# EAGLE design RPi_SPI_outputs_v03 (EAGLE 7.2.0)
AUTHOR: M.Petrilak; VERSION: 03
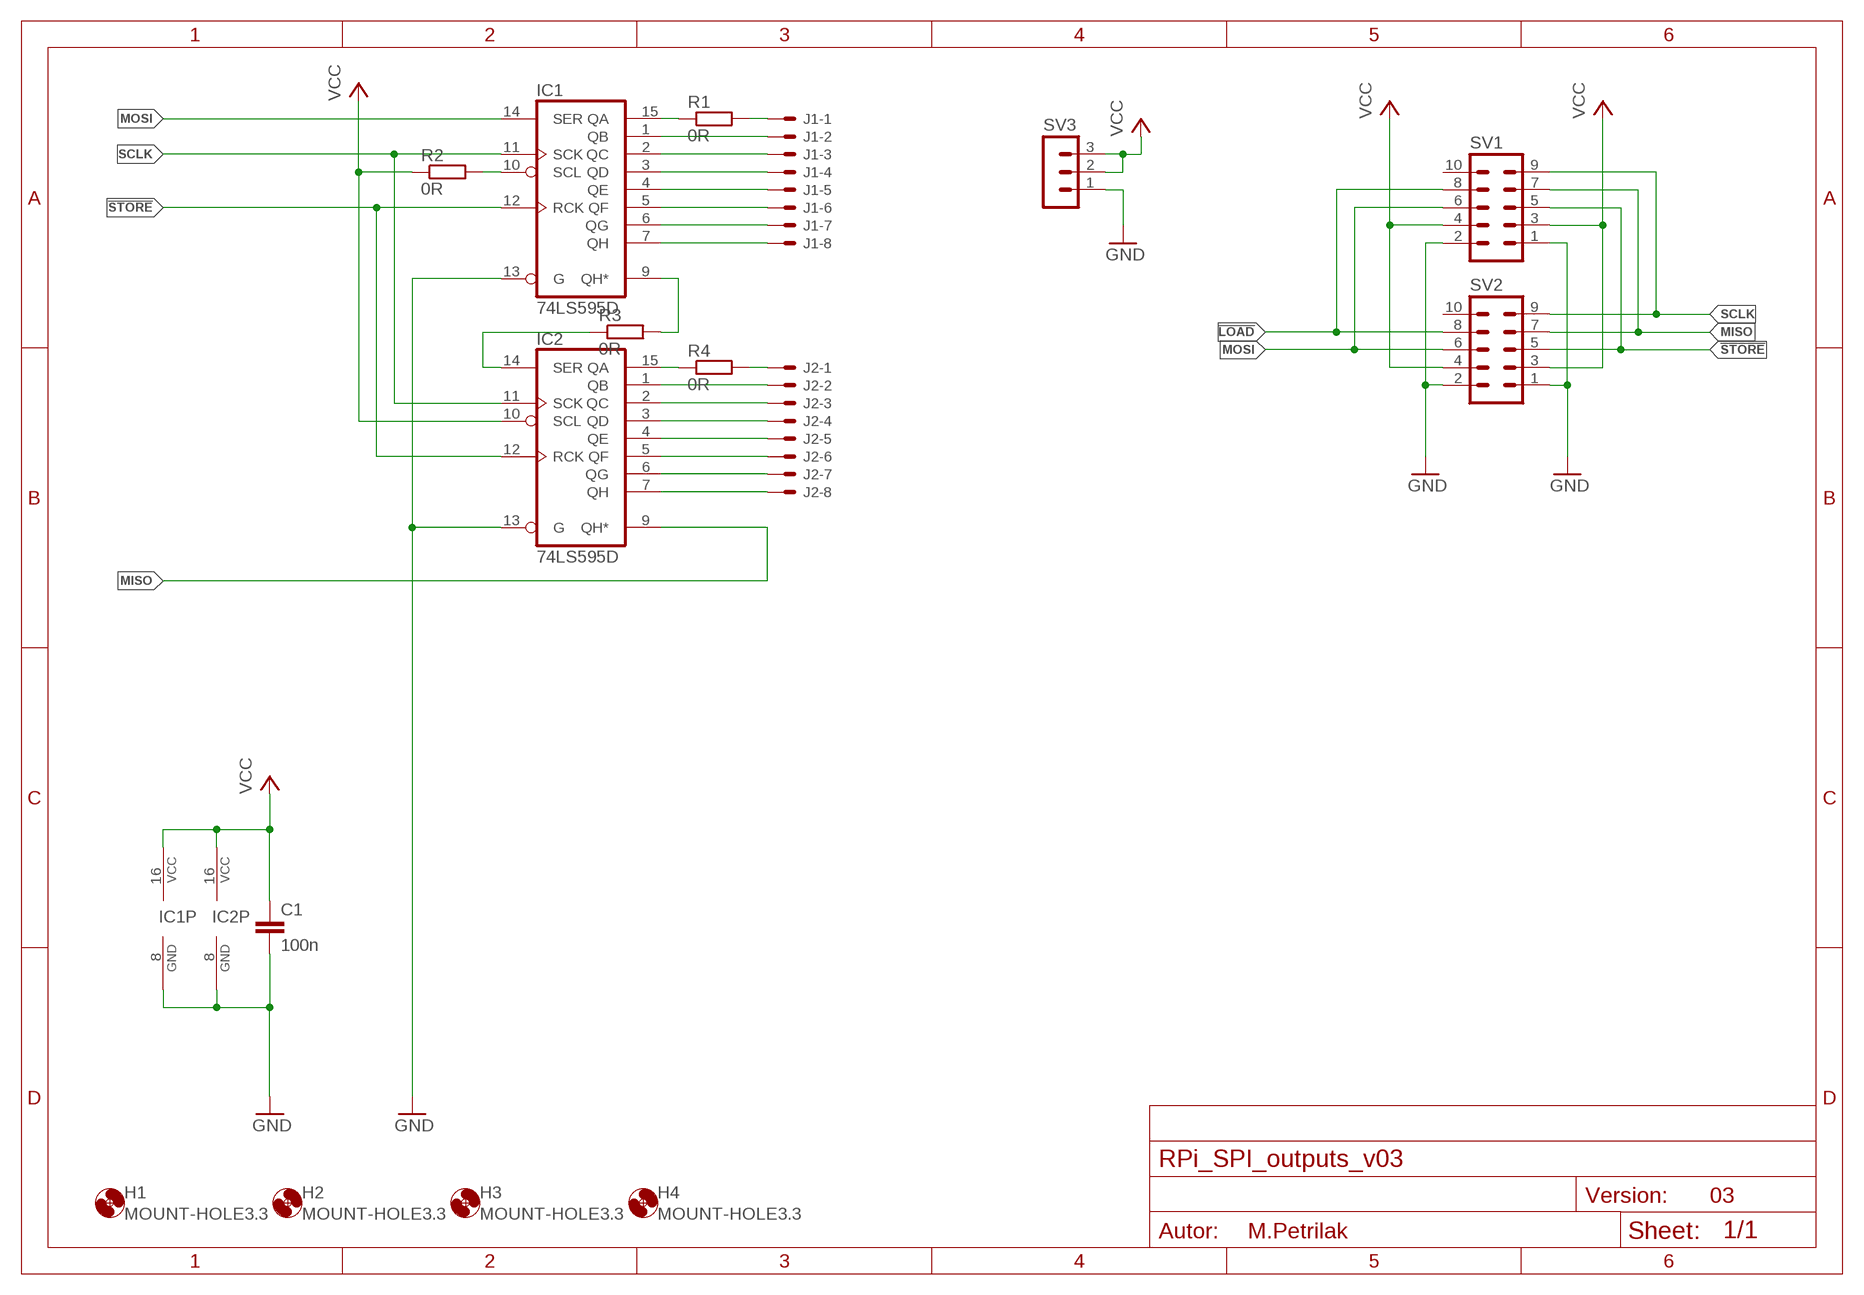
[diagram p0: schematic, sheet 1]

## Parts
C1  100n  C-EUC1206  [C1206]
H1  MOUNT-HOLE3.3  [3,3]
H2  MOUNT-HOLE3.3  [3,3]
H3  MOUNT-HOLE3.3  [3,3]
H4  MOUNT-HOLE3.3  [3,3]
IC1  74LS595D  [SO16]
IC2  74LS595D  [SO16]
J1  22-05-7088-SPEC-08  [7395-08_SPEC]
J2  22-05-7088-SPEC-08  [7395-08_SPEC]
R1  0R  R-EU_R1206  [R1206]
R2  0R  R-EU_R1206  [R1206]
R3  0R  R-EU_R1206  [R1206]
R4  0R  R-EU_R1206  [R1206]
SV1  ML10  [ML10]
SV2  ML10  [ML10]
SV3  MA03-1_NO  [MA03-1_NO]

## Nets
!LOAD: SV1.8 SV2.8
!STORE: IC1.12(RCK) IC2.12(RCK) SV1.5 SV2.5
GND: C1.2 IC1.8(GND) IC1.13(G) IC2.8(GND) IC2.13(G) SV1.1 SV1.2 SV2.1 SV2.2 SV3.1
MISO: IC2.9(QH*) SV1.7 SV2.7
MOSI: IC1.14(SER) SV1.6 SV2.6
N$1: J1.1 R1.2
N$2: IC1.1(QB) J1.2
N$3: IC1.2(QC) J1.3
N$4: IC1.3(QD) J1.4
N$5: IC1.4(QE) J1.5
N$6: IC1.5(QF) J1.6
N$7: IC1.6(QG) J1.7
N$8: IC1.7(QH) J1.8
N$9: J2.1 R4.2
N$10: IC2.1(QB) J2.2
N$11: IC2.2(QC) J2.3
N$12: IC2.3(QD) J2.4
N$13: IC2.4(QE) J2.5
N$14: IC2.5(QF) J2.6
N$15: IC2.6(QG) J2.7
N$16: IC2.7(QH) J2.8
N$17: IC2.14(SER) R3.1
N$18: IC2.15(QA) R4.1
N$19: IC1.15(QA) R1.1
N$20: IC1.10(SCL) R2.2
N$21: IC1.9(QH*) R3.2
SCLK: IC1.11(SCK) IC2.11(SCK) SV1.9 SV2.9
VCC: C1.1 IC1.16(VCC) IC2.10(SCL) IC2.16(VCC) R2.1 SV1.3 SV1.4 SV2.3 SV2.4 SV3.2 SV3.3
Unconnected: SV1.10 SV2.10

## Library data of the parts
C1 = rcl:C-EU: CAPACITOR, European symbol
H1-H4 = holes:MOUNT-HOLE: MOUNTING HOLE with drill center marker
IC1 IC2 = 74xx-us:74*595: 8-bit SHIFT REGISTER, output latch
J1 J2 = con-molex:22-?-08: CONNECTOR wire to board 2.54 mm (.1 inch) pitch header
R1-R4 = rcl:R-EU_: RESISTOR, European symbol
SV1 SV2 = con-harting-ml:ML10: HARTING
SV3 = con-lstb:MA03-1: PIN HEADER

## Board
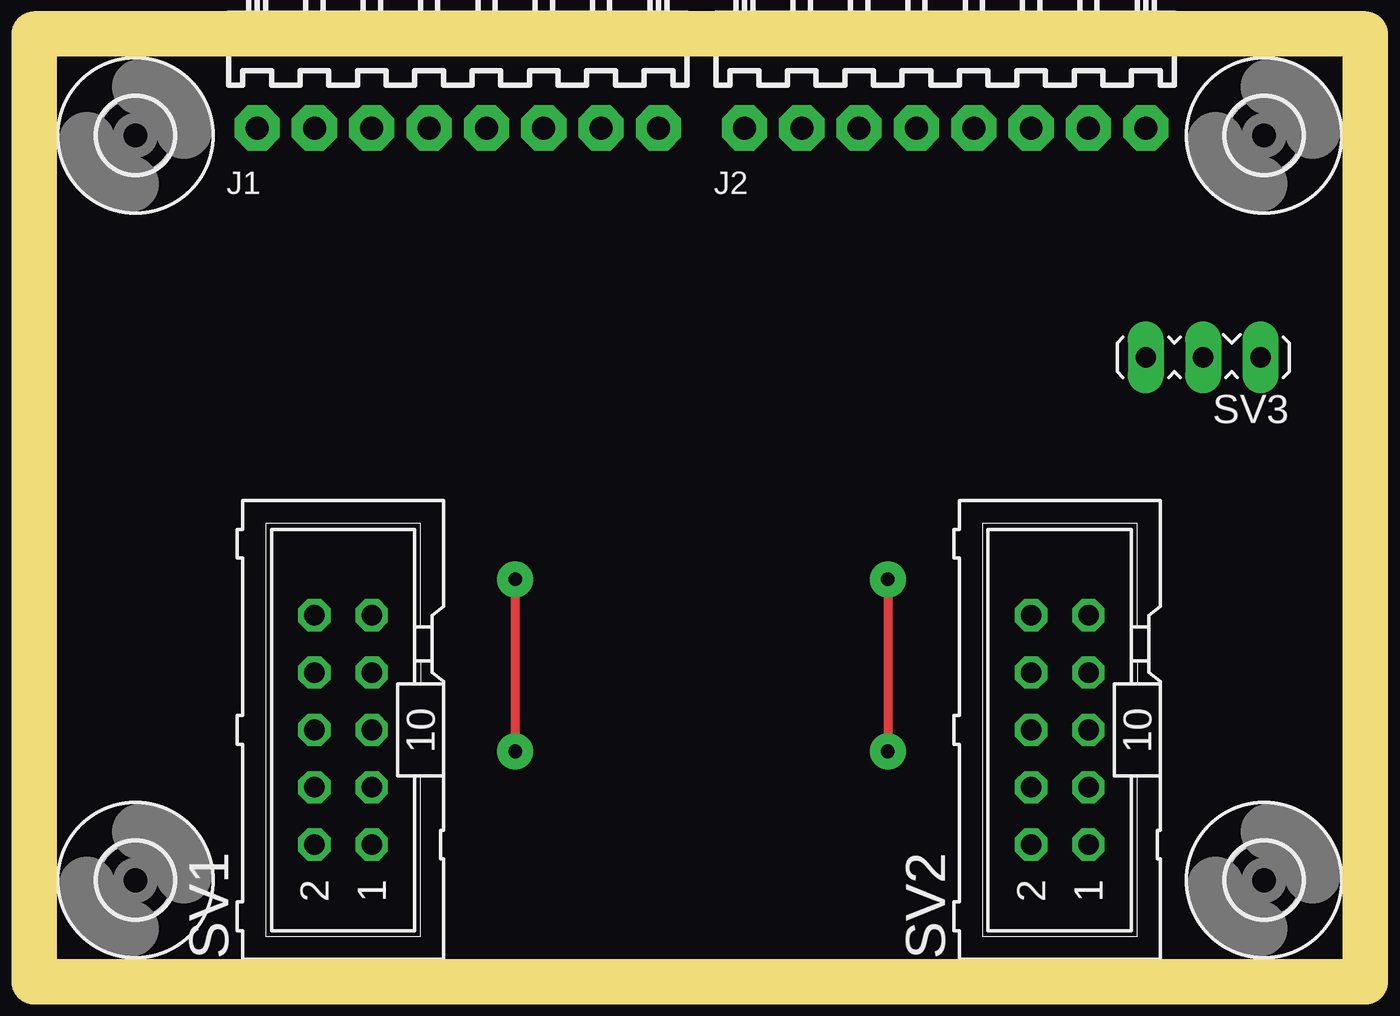
[diagram p1: board, top side]
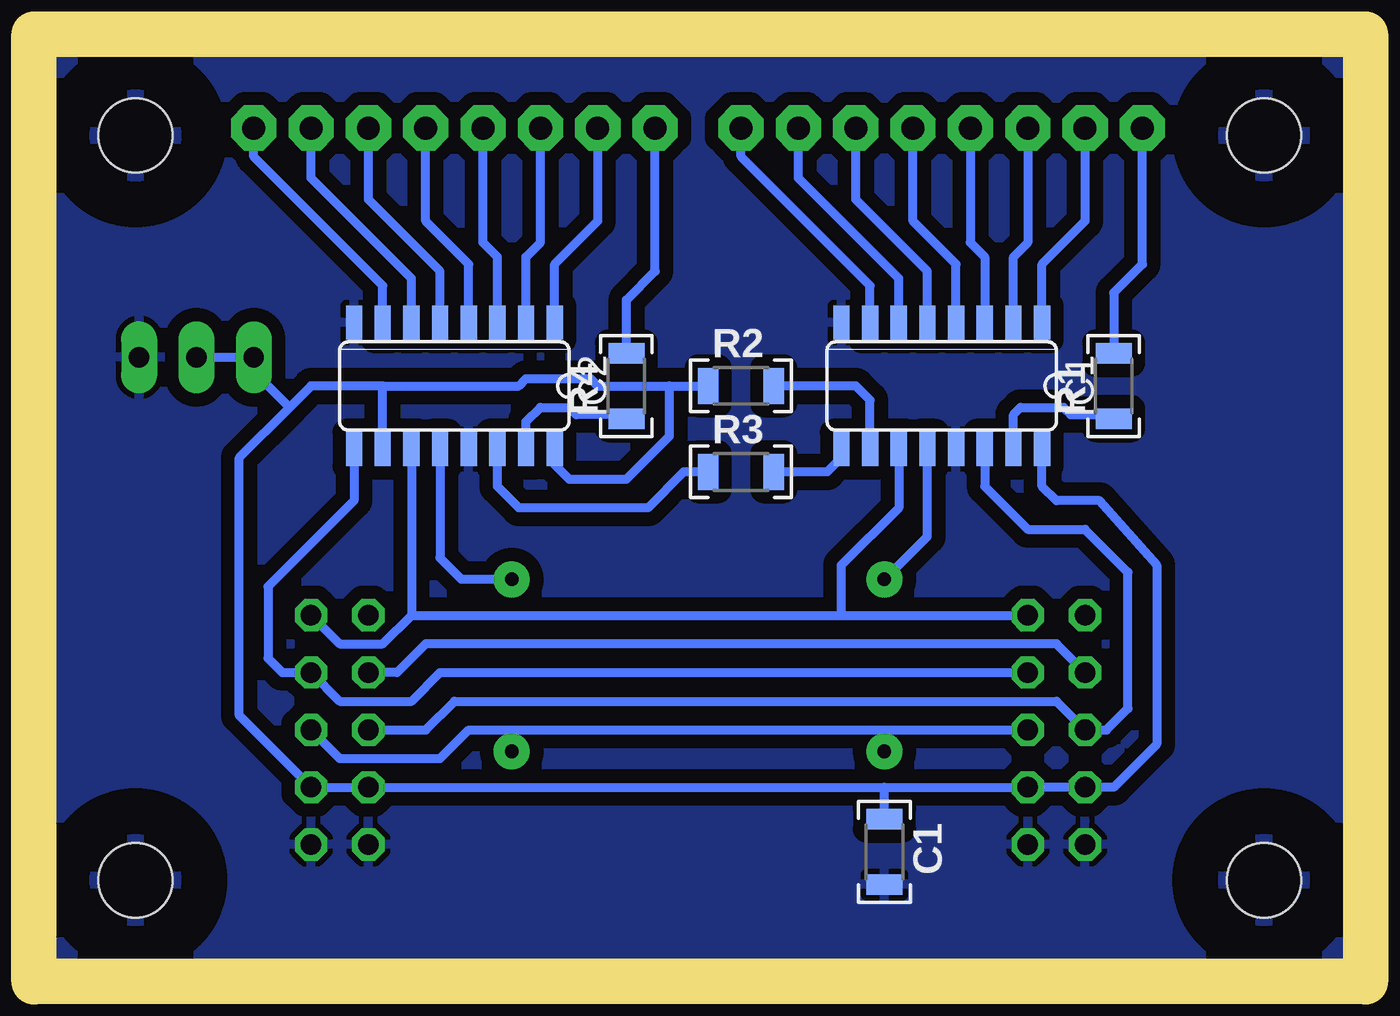
[diagram p2: board, bottom side, seen from below]

Size 57 x 40 mm. Coordinates in mm from the lower left corner, seen from the top.
Outline: 0,0 57,0 57,40 0,40 0,0
Copper layers (1*16): Top 0.035mm / dielectric 1.5mm / Bottom 0.035mm
Design rules "Michal_CNC_doma *": minimum track width 0.3mm, minimum drill 0.6mm, track to track 0.6mm, track to pad 0.6mm, pad to pad 0.4mm, via to via 0.4mm, smd to smd 8mil, copper to edge 1mil, drill to drill 8mil, minimum pad ring 10mil, minimum via ring 8mil, stop-mask expansion 4mil, vias tented up to drill 0mil, thermal gap 10mil
Milling: 4 lines

### Footprints (pad centres in the part's own frame; a part is rotated, then mirrored left to right if it is on the bottom)
C1206 = smd 0.9 x 1.6: 1 -1.45,0; 2 1.45,0
3,3 = hole 3.3: 0,0
SO16 = smd 0.72 x 1.5: 1 -4.445,-2.8; 2 -3.175,-2.8; 3 -1.905,-2.8; 4 -0.635,-2.8; 5 0.635,-2.8; 6 1.905,-2.8; 7 3.175,-2.8; 8 4.445,-2.8; 9 4.445,2.8; 10 3.175,2.8; 11 1.905,2.8; 12 0.635,2.8; 13 -0.635,2.8; 14 -1.905,2.8; 15 -3.175,2.8; 16 -4.445,2.8
7395-08_SPEC = drill 1.016 pad 2 octagon: 1 8.89,0; 2 6.35,0; 3 3.81,0; 4 1.27,0; 5 -1.27,0; 6 -3.81,0; 7 -6.35,0; 8 -8.89,0
R1206 = smd 0.9 x 1.6: 1 -1.45,0; 2 1.45,0
ML10 = drill 0.914 octagon: 1 -5.08,-1.27; 2 -5.08,1.27; 3 -2.54,-1.27; 4 -2.54,1.27; 5 0,-1.27; 6 0,1.27; 7 2.54,-1.27; 8 2.54,1.27; 9 5.08,-1.27; 10 5.08,1.27
MA03-1_NO = drill 0.9 pad 1.6 long: 1 -2.54,0; 2 0,0; 3 2.54,0

### Placement (x,y rotation side)
C1  20.32,4.76 270 bottom
H1  3.5,3.5 0 top
H2  53.5,3.5 0 top
H3  53.5,36.5 0 top
H4  3.5,36.5 0 top
IC1  17.78,25.4 180 bottom
IC2  39.37,25.4 180 bottom
J1  17.78,36.83 180 top
J2  39.37,36.83 180 top
R1  10.16,25.4 90 bottom
R2  26.67,25.4 0 bottom
R3  26.67,21.59 0 bottom
R4  31.75,25.4 90 bottom
SV1  12.7,10.16 90 top
SV2  44.45,10.16 90 top
SV3  50.8,26.67 180 top

### Tracks (layer width: path | path; a pad name or v marks a point on that pad's centre or on a via)
!LOAD
  Bottom 0.406: SV1.8 12.7,13.97 40.64,13.97 41.91,12.7 SV2.8
!STORE  (via drill 0.6 pad 1.6)
  Top 0.406: v20.32,16.83 v20.32,9.21 | v36.83,16.83 v36.83,9.21
  Bottom 0.406: SV2.5 44.45,8.89 40.01,8.89 38.73,10.16 36.83,10.16 | 36.83,10.16 20.32,10.16 | 20.32,10.16 SV1.5 | v20.32,9.21 20.32,10.16 | IC1.12 18.41,18.73 v20.32,16.83 | IC2.12 40.01,17.78 39.05,16.83 v36.83,16.83 | v36.83,9.21 36.83,10.16
GND
  pour Bottom: 0,0 57,0 57,40 0,40
MISO
  Bottom 0.406: SV1.7 40.01,12.7 41.27,11.43 44.45,11.43 SV2.7 46.99,12.7 47.62,13.34 47.62,16.51 43.81,20.32 IC2.9
MOSI
  Bottom 0.406: SV2.6 40.64,10.16 39.37,11.43 12.7,11.43 SV1.6 10.48,10.16 9.53,11.11 9.53,17.14 11.43,19.05 13.97,19.05 15.88,20.95 IC1.14
N$1
  Bottom 0.406: J1.1 8.89,30.8 10.16,29.53 R1.2
N$2
  Bottom 0.406: J1.2 11.43,32.7 13.34,30.8 IC1.1
N$3
  Bottom 0.406: IC1.2 14.61,31.11 13.97,31.75 J1.3
N$4
  Bottom 0.406: J1.4 16.51,31.75 15.88,31.11 IC1.3
N$5
  Bottom 0.406: IC1.4 17.14,30.8 19.05,32.7 J1.5
N$6
  Bottom 0.406: IC1.5 18.41,30.48 21.59,33.66 J1.6
N$7
  Bottom 0.406: IC1.6 19.68,30.16 24.13,34.61 J1.7
N$8
  Bottom 0.406: IC1.7 20.95,29.84 26.67,35.56 J1.8
N$9
  Bottom 0.406: J2.1 30.48,30.48 31.75,29.21 R4.2
N$10
  Bottom 0.406: J2.2 33.02,32.7 34.92,30.8 IC2.1
N$11
  Bottom 0.406: IC2.2 36.2,31.11 35.56,31.75 J2.3
N$12
  Bottom 0.406: IC2.3 37.47,31.11 38.1,31.75 J2.4
N$13
  Bottom 0.406: IC2.4 38.73,30.8 40.64,32.7 J2.5
N$14
  Bottom 0.406: IC2.5 40.01,30.48 43.18,33.66 J2.6
N$15
  Bottom 0.406: IC2.6 41.27,30.16 45.72,34.61 J2.7
N$16
  Bottom 0.406: IC2.7 42.55,29.84 48.26,35.56 J2.8
N$17
  Bottom 0.406: IC2.14 37.47,20.95 36.51,20 30.8,20 29.21,21.59 R3.1
N$18
  Bottom 0.406: IC2.15 36.2,23.81 35.56,24.45 34.29,24.45 33.97,24.13 31.93,24.13 R4.1
N$19
  Bottom 0.406: IC1.15 14.61,24.13 14.29,24.45 12.38,24.45 12.06,24.13 10.34,24.13 R1.1
N$20
  Bottom 0.406: IC1.10 20.95,24.77 21.59,25.4 R2.2
N$21
  Bottom 0.406: IC1.9 22.23,22.23 22.86,21.59 R3.2
SCLK
  Bottom 0.406: SV2.9 44.45,13.97 42.55,13.97 41.27,15.24 | 41.27,15.24 22.23,15.24 | 22.23,15.24 SV1.9 | IC2.11 41.27,15.24 | 22.23,15.24 22.23,17.46 19.68,20 IC1.11
VCC
  Bottom 0.406: 20.32,7.62 SV2.4 SV2.3 48.9,10.79 48.9,22.23 46.67,24.45 | 20.32,7.62 SV1.3 SV1.4 10.16,7.62 8.26,9.53 8.26,17.46 10.79,20.32 12.7,20.32 13.34,20.95 IC1.16 13.34,22.23 | IC2.10 42.55,25.4 | 42.55,25.4 45.72,25.4 46.67,24.45 | C1.1 20.32,7.62 | 42.55,25.4 36.51,25.4 36.2,25.72 33.34,25.72 33.02,25.4 29.84,25.4 | 29.84,25.4 R2.1 | IC2.16 34.92,21.91 34.29,21.27 31.75,21.27 29.84,23.18 29.84,25.4 | SV3.2 SV3.3 48.26,26.04 46.67,24.45